# EAGLE schematic d_ff (EAGLE 7.3.0)
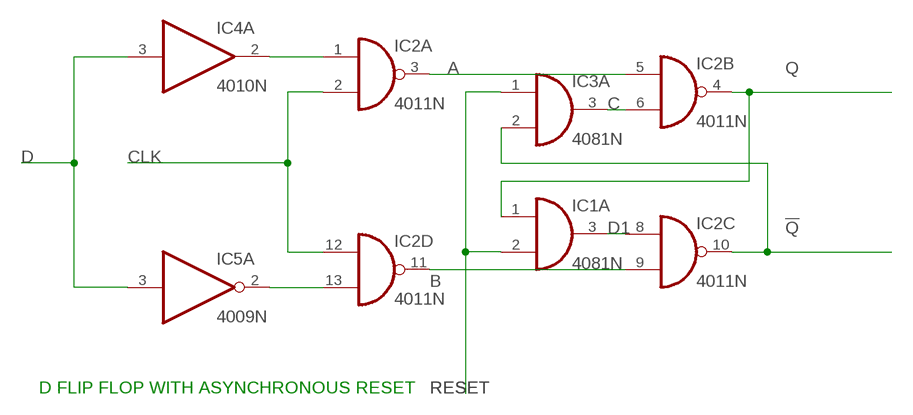
[diagram p0: schematic, sheet 1]

## Parts
IC1  4081N  [DIL14]
IC2  4011N  [DIL14]
IC3  4081N  [DIL14]
IC4  4010N  [DIL16]
IC5  4009N  [DIL16]

## Nets
!Q: IC2.10(C:O) IC3.2(A:I1)
A: IC2.3(A:O) IC2.5(B:I0)
B: IC2.9(C:I1) IC2.11(D:O)
C: IC2.6(B:I1) IC3.3(A:O)
CLK: IC2.2(A:I1) IC2.12(D:I0)
D: IC4.3(A:I) IC5.3(A:I)
D1: IC1.3(A:O) IC2.8(C:I0)
N$2: IC2.1(A:I0) IC4.2(A:O)
N$6: IC2.13(D:I1) IC5.2(A:O)
Q: IC1.1(A:I0) IC2.4(B:O)
RESET: IC1.2(A:I1) IC3.1(A:I0)
Unconnected: IC1.4(B:O) IC1.5(B:I0) IC1.6(B:I1) IC1.8(C:I0) IC1.9(C:I1) IC1.10(C:O) IC1.11(D:O) IC1.12(D:I0) IC1.13(D:I1) IC3.4(B:O) IC3.5(B:I0) IC3.6(B:I1) IC3.8(C:I0) IC3.9(C:I1) IC3.10(C:O) IC3.11(D:O) IC3.12(D:I0) IC3.13(D:I1) IC4.4(B:O) IC4.5(B:I) IC4.6(C:O) IC4.7(C:I) IC4.9(D:I) IC4.10(D:O) IC4.11(E:I) IC4.12(E:O) IC4.14(F:I) IC4.15(F:O) IC5.4(B:O) IC5.5(B:I) IC5.6(C:O) IC5.7(C:I) IC5.9(D:I) IC5.10(D:O) IC5.11(E:I) IC5.12(E:O) IC5.14(F:I) IC5.15(F:O)

## Notes on the sheet
- D FLIP FLOP WITH ASYNCHRONOUS RESET

## Power pins joined to a net without a drawn wire
VCC: IC4.1(P:VCC) IC5.1(P:VCC)
VDD: IC1.14(P:VDD) IC2.14(P:VDD) IC3.14(P:VDD) IC4.16(P:VDD) IC5.16(P:VDD)
VSS: IC1.7(P:VSS) IC2.7(P:VSS) IC3.7(P:VSS) IC4.8(P:VSS) IC5.8(P:VSS)

## Library data of the parts
IC1 IC3 = 40xx:4081: Quad 2-input AND
IC2 = 40xx:4011: Quad 2-input NAND
IC4 = 40xx:4010: Hex BUFFER, non-inverting Source: www.fairchildsemi.com CD4010.pdf © 2000 Fairchild Semiconductor Corporation DS005945
IC5 = 40xx:4009: Hex BUFFER, inverting